# Altium project BQ79616-Q1_BMS_Slave.PrjPcb (part 1 of 2)
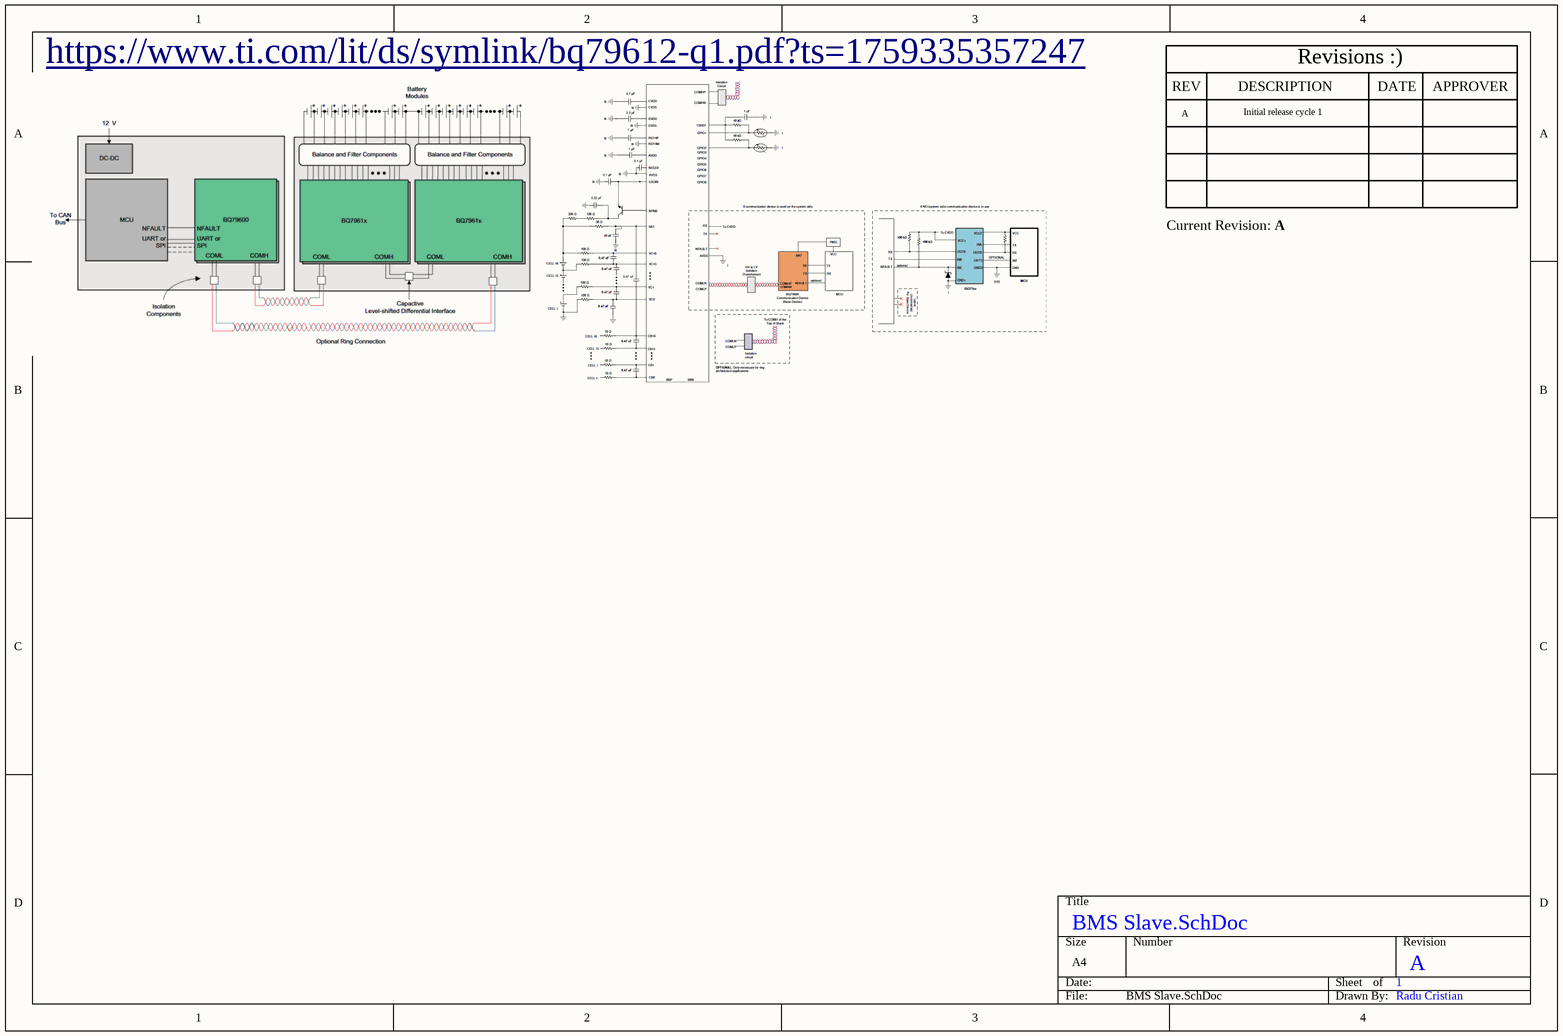
[diagram p0: BMS Slave.SchDoc]
Revision: A
8 sheets, 174 parts. Net scope: flat (ports and power ports of the same name join across sheets).
Board file: BMS_Slave_RevA.PcbDoc
Sheets:
  BMS Slave.SchDoc
  BQ chip.SchDoc
  Power Delivery.SchDoc
  Cell Balancing.SchDoc
  Cell Voltage Sensing.SchDoc
  Thermistors.SchDoc
  Communication.SchDoc
  Connectors.SchDoc

## Sheet BMS Slave.SchDoc
size A4; SheetNumber: 1; SheetTotal: 8

### Notes on the sheet
- https://www.ti.com/lit/ds/symlink/bq79612-q1.pdf?ts=1759335357247
- REV
- A
- DESCRIPTION
- Initial release cycle 1
- Revisions :)
- DATE
- APPROVER
- Current Revision:
- Radu Cristian

## Sheet BQ chip.SchDoc
size A4; SheetNumber: 2; SheetTotal: 8
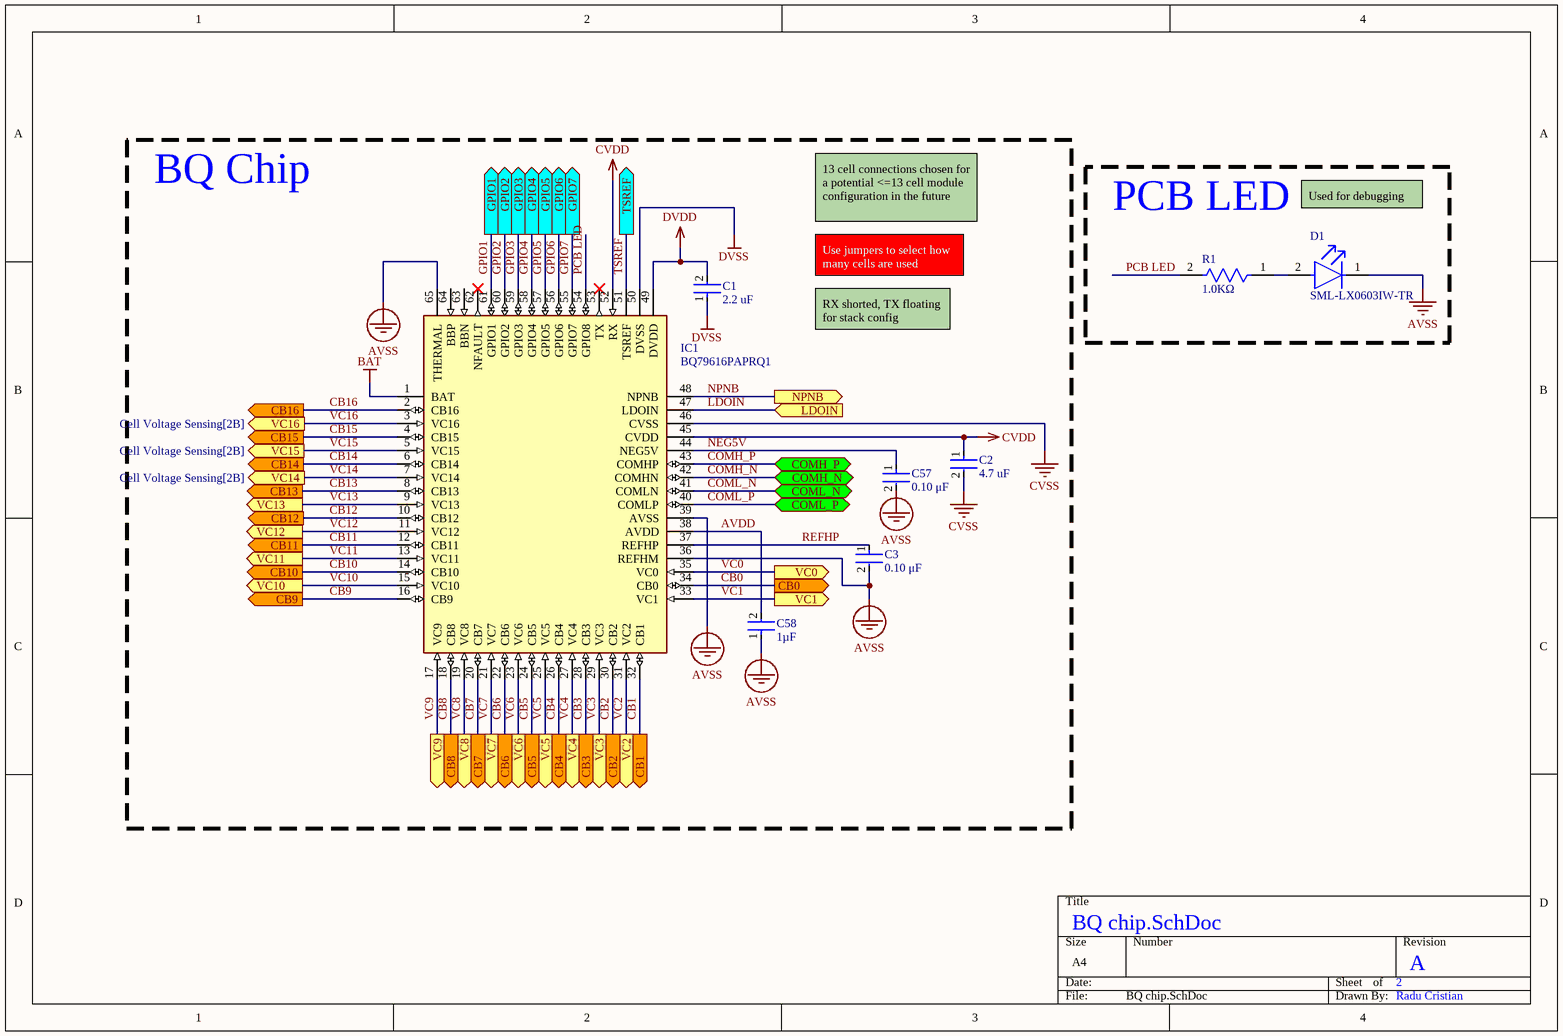
[diagram p1: BQ chip.SchDoc]

### Parts
C1  Capacitance: 2.2 uF  [FP-CC0603-DA-MFG]  (hidden comment: CC0603KPX7R6BB225)
C2  Capacitance: 4.7 uF  [FP-CC0603-DA-MFG]  (hidden comment: CC0603KRX5R7BB475)
C3  value 0.10 μF  [FP-C0603C-CF-MFG]  (hidden comment: C0603C104J5RAC)
C57  value 0.10 μF  [FP-C0603C-CF-MFG]  (hidden comment: C0603C104J5RAC)
C58  Capacitance: 1µF  [FP-VJ0603Y105KXJCW1BC-MFG]  (hidden comment: VJ0603Y105KXJCW1BC)
D1  SML-LX0603IW-TR  [FP-SML-LX0603IW-TR-MFG]
IC1  BQ79616PAPRQ1  [QFP50P1200X1200X120-65N]
R1  Resistance: 1.0KΩ  [FP-CPF0603-MFG]  (hidden comment: CPF0603F1K0C1)

### Blocks framed on the sheet
BQ Chip: C1-C3 C57 C58 IC1
PCB LED: D1 R1

### Ports
CB0 (out, see Cell Balancing[2D]), CB1 (out, see Cell Balancing[2D]), CB2 (out, see Cell Balancing[2D]), CB3 (out, see Cell Balancing[2C]), CB4 (out, see Cell Balancing[2C]), CB5 (out, see Cell Balancing[2C]), CB6 (out, see Cell Balancing[2C]), CB7 (out, see Cell Balancing[2C]), CB8 (out, see Cell Balancing[2C]), CB9 (out, see Cell Balancing[2B]), CB10 (out, see Cell Balancing[2B]), CB11 (out, see Cell Balancing[2B]), CB12 (out, see Cell Balancing[2B]), CB13 (out, see Cell Balancing[2B]), CB14 (out, see Cell Balancing[2B]), CB15 (out, see Cell Balancing[2B]), CB16 (out, see Cell Balancing[2A]), COMH_N (bidir, see Communication[1C]), COMH_P (bidir, see Communication[1B]), COML_N (bidir, see Communication[1A]), COML_P (bidir, see Communication[1B]), GPIO1 (out, see Thermistors[1D]), GPIO2 (out, see Thermistors[1D]), GPIO3 (out, see Thermistors[1C]), GPIO4 (out, see Thermistors[1C]), GPIO5 (out, see Thermistors[1C]), GPIO6 (out, see Thermistors[1A]), GPIO7 (out, see Thermistors[1A]), LDOIN (in, see Power Delivery[1C]), NPNB (out, see Power Delivery[1C]), TSREF (out, see Thermistors[1A], Thermistors[1B]), VC0 (out, see Cell Voltage Sensing[2D]), VC1 (out, see Cell Voltage Sensing[2D]), VC2 (out, see Cell Voltage Sensing[2D]), VC3 (out, see Cell Voltage Sensing[2D]), VC4 (out, see Cell Voltage Sensing[2C]), VC5 (out, see Cell Voltage Sensing[2C]), VC6 (out, see Cell Voltage Sensing[2C]), VC7 (out, see Cell Voltage Sensing[2C]), VC8 (out, see Cell Voltage Sensing[2C]), VC9 (out, see Cell Voltage Sensing[2C]), VC10 (out, see Cell Voltage Sensing[2B]), VC11 (out, see Cell Voltage Sensing[2B]), VC12 (out, see Cell Voltage Sensing[2B]), VC13 (out, see Cell Voltage Sensing[2B]), VC14 (out, see Cell Voltage Sensing[2B]), VC15 (out, see Cell Voltage Sensing[2B]), VC16 (out, see Cell Voltage Sensing[2B])

### Nets
AVSS: C3.2 C57.2 C58.1 D1.1(C) IC1.36(REFHM) IC1.39(AVSS) IC1.65(THERMAL)
BAT: IC1.1(BAT)
CVDD: C2.1 IC1.45(CVDD) IC1.52(RX)
CVSS: C2.2 IC1.46(CVSS)
DVDD: C1.2 IC1.49(DVDD)
DVSS: C1.1 IC1.50(DVSS)
AVDD: C58.2 IC1.38(AVDD)
CB0: IC1.34(CB0) ; port CB0
CB1: IC1.32(CB1) ; port CB1
CB2: IC1.30(CB2) ; port CB2
CB3: IC1.28(CB3) ; port CB3
CB4: IC1.26(CB4) ; port CB4
CB5: IC1.24(CB5) ; port CB5
CB6: IC1.22(CB6) ; port CB6
CB7: IC1.20(CB7) ; port CB7
CB8: IC1.18(CB8) ; port CB8
CB9: IC1.16(CB9) ; port CB9
CB10: IC1.14(CB10) ; port CB10
CB11: IC1.12(CB11) ; port CB11
CB12: IC1.10(CB12) ; port CB12
CB13: IC1.8(CB13) ; port CB13
CB14: IC1.6(CB14) ; port CB14
CB15: IC1.4(CB15) ; port CB15
CB16: IC1.2(CB16) ; port CB16
COMH_N: IC1.42(COMHN) ; port COMH_N
COMH_P: IC1.43(COMHP) ; port COMH_P
COML_N: IC1.41(COMLN) ; port COML_N
COML_P: IC1.40(COMLP) ; port COML_P
GPIO1: IC1.61(GPIO1) ; port GPIO1
GPIO2: IC1.60(GPIO2) ; port GPIO2
GPIO3: IC1.59(GPIO3) ; port GPIO3
GPIO4: IC1.58(GPIO4) ; port GPIO4
GPIO5: IC1.57(GPIO5) ; port GPIO5
GPIO6: IC1.56(GPIO6) ; port GPIO6
GPIO7: IC1.55(GPIO7) ; port GPIO7
LDOIN: IC1.47(LDOIN) ; port LDOIN
NEG5V: C57.1 IC1.44(NEG5V)
NPNB: IC1.48(NPNB) ; port NPNB
PCB LED: IC1.54(GPIO8) R1.2
REFHP: C3.1 IC1.37(REFHP)
TSREF: IC1.51(TSREF) ; port TSREF
VC0: IC1.35(VC0) ; port VC0
VC1: IC1.33(VC1) ; port VC1
VC2: IC1.31(VC2) ; port VC2
VC3: IC1.29(VC3) ; port VC3
VC4: IC1.27(VC4) ; port VC4
VC5: IC1.25(VC5) ; port VC5
VC6: IC1.23(VC6) ; port VC6
VC7: IC1.21(VC7) ; port VC7
VC8: IC1.19(VC8) ; port VC8
VC9: IC1.17(VC9) ; port VC9
VC10: IC1.15(VC10) ; port VC10
VC11: IC1.13(VC11) ; port VC11
VC12: IC1.11(VC12) ; port VC12
VC13: IC1.9(VC13) ; port VC13
VC14: IC1.7(VC14) ; port VC14
VC15: IC1.5(VC15) ; port VC15
VC16: IC1.3(VC16) ; port VC16
NetD1_2: D1.2(A) R1.1

Not connected (* = marked no-connect by the designer): IC1 53(TX)* 62(NFAULT)* 63(BBN) 64(BBP)

### Notes on the sheet
- 13 cell connections chosen for a potential <=13 cell module configuration in the future
- Used for debugging
- Use jumpers to select how many cells are used
- RX shorted, TX floating for stack config
- Radu Cristian

### Library data of the parts
C1 = CMP-03422-000630-1: CC0603 2.2 uF X7R 10.00% 10 V; Manufacturer: YAGEO; Value: 2.2 uF; Tolerance: 0.1; Voltage Rating: 10 V; Temperature Coefficient: 15%; Material: Ceramic; Automotive: No; ComponentLink2URL: http://www.yageo.com/documents/recent/UPY-GPHC_X7R_6.3V-to-50V_18.pdf; Temperature Range Low: -55°C; Package: CC0603-DA; Lead Free: Yes; RoHS: TRUE; Manufacturer Part Number: CC0603KPX7R6BB225; Height: 0.9mm; Octopart: https://octopart.com/cc0603kpx7r6bb225-yageo-88116733; ComponentLink2Description: Datasheet; Category: Cap; Device Class L1: Passive Components; Temperature: -55°C to +125°C; Footprint Url: http://www.yageo.com/exep/pages/download/literatures/UPY-C_GEN_24.pdf; Voltage: 10 V; Temperature Range High: +125°C; Device Class L3: Ceramic Capacitors; Device Class L2: Capacitors; Temperature Characteristic: X7R
C2 = CMP-03422-001236-1: CAP CER 4.7UF 16V X5R 0603; Manufacturer: YAGEO; Temperature Coefficient: 15%; Material: Ceramic; Tolerance: 0.1; Temperature Characteristic: X5R; Footprint Url: http://www.yageo.com/exep/pages/download/literatures/UPY-C_GEN_24.pdf; ComponentLink2URL: http://www.yageo.com/documents/recent/UPY-GPHC_X7R_6.3V-to-50V_18.pdf; ComponentLink2Description: Datasheet; Device Class L3: Ceramic Capacitors; Category: Cap; Voltage Rating: 16 V; Automotive: No; Temperature Range High: +125°C; Value: 4.7 uF; Device Class L1: Passive Components; RoHS: TRUE; Manufacturer Part Number: CC0603KRX5R7BB475; Device Class L2: Capacitors; Voltage: 16 V; Height: 0.9mm; Temperature Range Low: -55°C; Temperature: -55°C to +125°C; Mouser Description: Multilayer Ceramic Capacitors MLCC - SMD/SMT 4.7uF 16V X5R 10%; Octopart: https://octopart.com/cc0603krx5r7bb475-yageo-34978295; Package: CC0603-DA; Lead Free: Yes; Digikey Description: CAP CER 4.7UF 16V X5R 0603
C3 C57 = CMP-03020-003374-1: C0603 0.10 μF X7R 30ppm/°C 5.00% 50 V; Manufacturer: KEMET; Automotive Grade: Grade 1; Voltage Rating: 50 V; Tolerance: 0.05; Material: Ceramic; Manufacturer Part Number: C0603C104J5RAC; Mouser Description: Cap Ceramic 0.1uF 50V X7R 5% Pad SMD 0603 125C Bulk; Temperature Range High: +125°C; Package: C0603C-CF; Device Class L1: Passive Components; Temperature Range Low: -55°C; Capacitance: 0.10 μF; Category: Cap; ComponentLink2Description: Datasheet; Lead Free: Yes; Temperature Coefficient: 30ppm/°C; Octopart: https://octopart.com/c0603c104j5rac-kemet-8089723; Automotive: Yes; Temperature Characteristic: X7R; ComponentLink2URL: https://api.kemet.com/component-edge/download/datasheet/C0603C100J5GACAUTO.pdf; Height: 0.87mm; Device Class L2: Capacitors; Device Class L3: Ceramic Capacitors; Temperature: -55°C to +125°C; RoHS: TRUE
C58 = CMP-00030-45106517-1: VJ0603Y105KXJCW1BC Multilayer Ceramic Capacitor, 1 uF, 16 V, ± 10%, X7R, 0603 [1608 Metric]; Voltage Rating: 16V; Dielectric Material: Tantalum; Radiation Hardening: No; RoHS: Compliant; Packaging: Tape and Reel; Material: Ceramic; Height: 950µm; Voltage Rating (DC): 16V; Tolerance: 10%; NexarPartId: 45106517; Min Operating Temperature: -55°C; Depth: 800µm; Case/Package: 0603; Length: 1.6mm; Max Operating Temperature: 125°C; Mount: Surface Mount; Lead Free: Lead Free; Dielectric: X7R
D1 = CMP-57192-000012-1: LED RED DIFFUSED SMD; Luminous Intensity: 14mcd; Test Current: 20mA; Viewing Angle: 160°; Approvals: UL; Forward Voltage: 2V; Power Dissipation: 50mW; Dominant Wavelength: 635nm; Number of LEDs: 1; Lens Color: White; Height: 0.6mm; RoHS Compliant: Yes; Lead Free: Lead Free; Number of Pins: 2; Packaging: Tape and Reel; Case/Package: 0603; Length: 1.6mm; Color: Red; Max Operating Temperature: 85°C; Illumination Color: Red; Case Code (Metric): 1608; Diameter: 0.061inch; Min Operating Temperature: -25°C; Lens Style: Diffused; Mount: Surface Mount; Width: 0.8mm; Case Code (Imperial): 0603; Lens Transparency: Diffused; Wavelength: 635nm; Package Quantity: 1; Forward Current: 20mA
IC1 = BQ79616PAPRQ1: 16-S automotive precision battery monitor, balancer and integrated protector with ASIL-D compliance; Manufacturer_Name: Texas Instruments; Datasheet Link: https://www.ti.com/lit/ds/symlink/bq79616-q1.pdf?ts=1617242170659&ref_url=https%253A%252F%252Fwww.ti.com%252Fproduct%252FBQ79616-Q1; Height: 1.2mm; Manufacturer_Part_Number: BQ79616PAPRQ1; Mouser Part Number: 595-BQ79616PAPRQ1; Mouser Price/Stock: https://www.mouser.co.uk/ProductDetail/Texas-Instruments/BQ79616PAPRQ1?qs=eP2BKZSCXI7ZLEv8EAihLQ%3D%3D; Arrow Part Number: BQ79616PAPRQ1; Arrow Price/Stock: https://www.arrow.com/en/products/bq79616paprq1/texas-instruments?region=nac; Supplier 1: DigiKey; Supplier Part Number 1: 296-BQ79616PAPRQ1CT-ND
R1 = CMP-03211-002621-1: RES SMD 1.0KΩ 1% 1/16W 0603; Manufacturer: TE Connectivity; Power Rating: 0.063W; Voltage Rating: 50V; Temperature Coefficient: 50ppm/°C; Octopart: https://octopart.com/cpf0603f1k0c1-te+connectivity-42013134; packaging: 1k Reel; Category: Res; Device Class L3: Chip SMD Resistors; octopart_url: https://octopart.com/cpf0603f1k0c1-te+connectivity-42013134; Value: 1.0KΩ; Temperature: -55°C to +155°C; Composition: Thin Film; ComponentLink2URL: https://www.te.com/commerce/DocumentDelivery/DDEController?Action=showdoc&DocId=Data+Sheet%7F1773200%7FM%7Fpdf%7FEnglish%7FENG_DS_1773200_M.pdf%7F3-1676481-2; Tolerance: 1%; Automotive: No; Lead Free: Yes; Height: 0.55mm; Device Class L1: Passive Components; Device Class L2: Resistors; Ipc Land Pattern Name: RESC15580X45; Series: CPF; ComponentLink2Description: Datasheet; RoHS: TRUE; Package: CPF0603; Manufacturer Part Number: CPF0603F1K0C1; Temperature Range Low: -55°C; Temperature Range High: +155°C

## Sheet Power Delivery.SchDoc
size A4; SheetNumber: 3; SheetTotal: 8
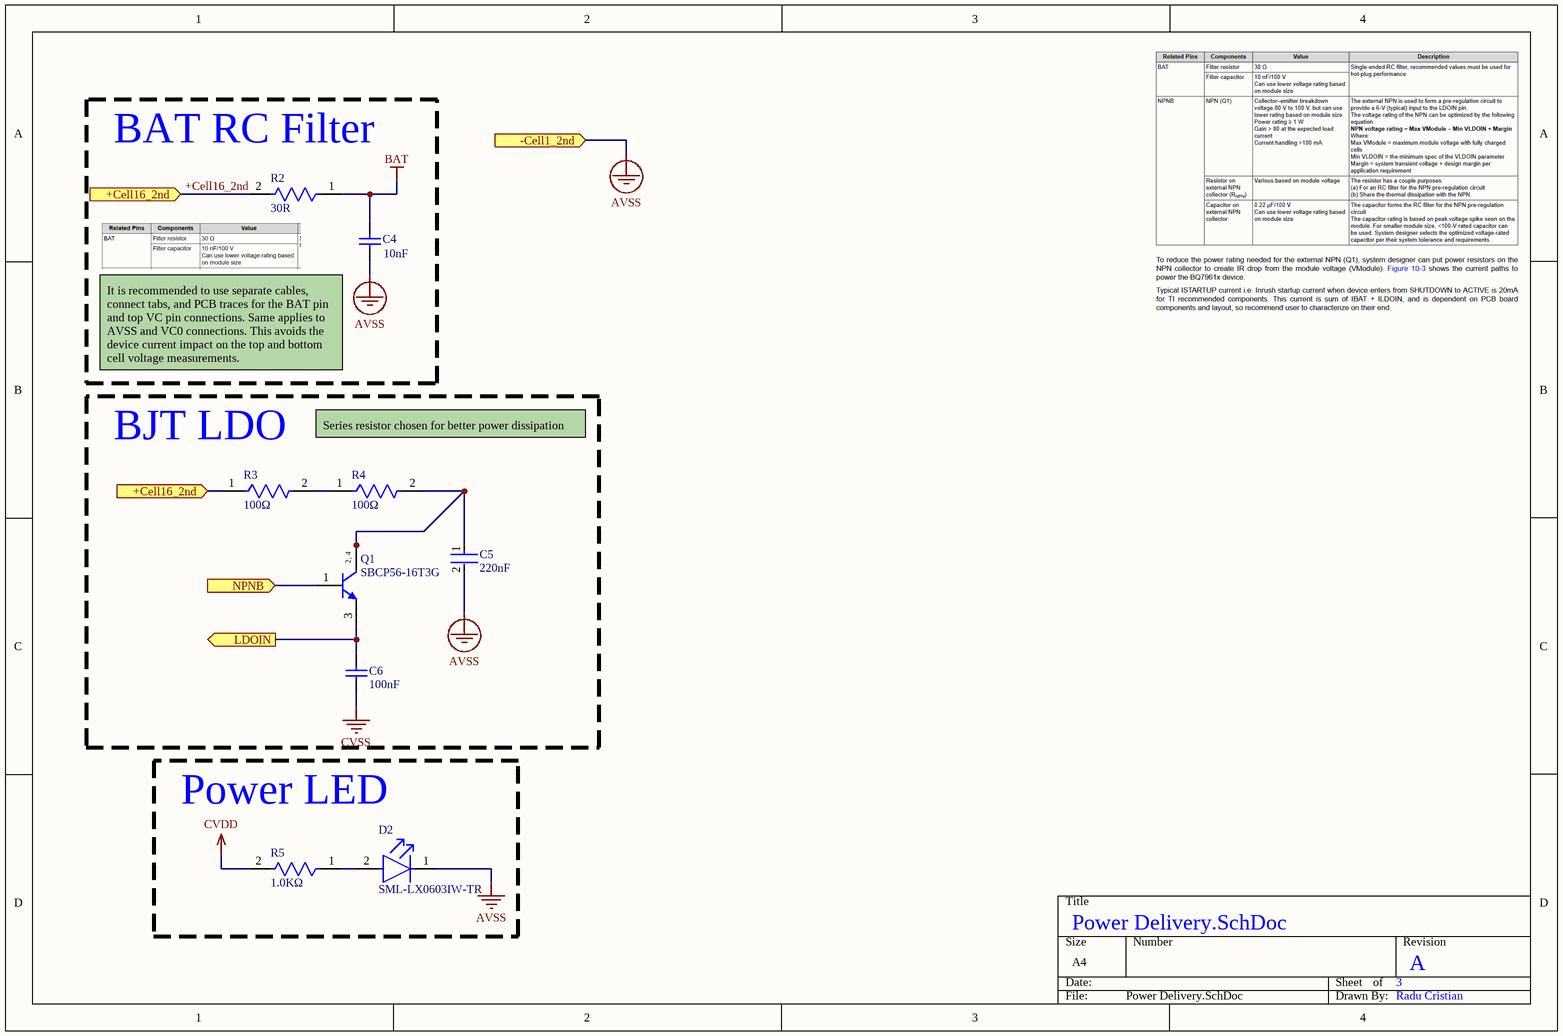
[diagram p2: Power Delivery.SchDoc]

### Parts
C4  Parameter 1: 10nF  [CAPC1608X92X38LL15T08]  (hidden comment: VJ0603Y103JXBAC)
C5  Capacitance: 220nF  [FP-0805-L_2_01_0_2-W_1_25-MFG]  (hidden comment: 08051C224K4T2A)
C6  Parameter 1: 100nF  [CAPC1608X92X38ML15T08]  (hidden comment: VJ0603Y104KXAAT)
D2  SML-LX0603IW-TR  [FP-SML-LX0603IW-TR-MFG]
Q1  SBCP56-16T3G  [ONSC-SOT-223-4-318E-04_V]
R2  Resistance: 30R  [FP-AC0603-IPC_C]  (hidden comment: AC0603FR-0730RL)
R3  Resistance: 100Ω  [FP-SR0805-MFG]  (hidden comment: SR0805FR-47100RL)
R4  Resistance: 100Ω  [FP-SR0805-MFG]  (hidden comment: SR0805FR-47100RL)
R5  Resistance: 1.0KΩ  [FP-CPF0603-MFG]  (hidden comment: CPF0603F1K0C1)

### Blocks framed on the sheet
BAT RC Filter: C4 R2
BJT LDO: C5 C6 Q1 R3 R4
Power LED: D2 R5

### Ports
+Cell16_2nd (in, see Connectors[2C], Power Delivery[1A]), +Cell16_2nd (in, see Connectors[2C], Power Delivery[1B]), -Cell1_2nd (in, see Connectors[1A]), LDOIN (out, see BQ chip[2B]), NPNB (in, see BQ chip[2B])

### Nets
AVSS: C4.1 C5.2 D2.1(C) ; port -Cell1_2nd
BAT: C4.2 R2.1
CVDD: R5.2
CVSS: C6.1
+Cell16_2nd: R2.2 R3.1 ; port +Cell16_2nd
LDOIN: C6.2 Q1.3(E) ; port LDOIN
NPNB: Q1.1(B) ; port NPNB
NetC5_1: C5.1 Q1.2(C) Q1.4(C) R4.2
NetD2_2: D2.2(A) R5.1
NetR3_2: R3.2 R4.1

### Notes on the sheet
- (near C4) It is recommended to use separate cables, connect tabs, and PCB traces for the BAT pin and top VC pin connections. Same applies to AVSS and VC0 connections. This avoids the device current impact on the top and bottom cell voltage measurements.
- Series resistor chosen for better power dissipation
- Radu Cristian
- (in symbol CMP-1048-00520-1) 2, 4

### Library data of the parts
C4 = CMP-2006-01162-1: Manufacturer: Vitramon; Part Number: VJ0603Y103JXBAC
C5 = CMP-04427-012849-1: Automotive Ceramic Capacitor, 0805, 220nF, 10%, X7R, 15%, 100V; Voltage Rating (DC): 100V; Dielectric: X7R; Length: 2.01mm; Contact Plating: Tin; Termination: Wraparound; Case/Package: 0805; RoHS Compliant: Yes; Tolerance: 10%; Max Operating Temperature: 125°C; Min Operating Temperature: -55°C; Mount: Surface Mount
C6 = CMP-2006-00164-1: Ceramic Capacitor, Multilayer, Ceramic, 50V, 10% +Tol, 10% -Tol, X7R, 15% TC, 0.1uF, Surface Mount, 0603; Manufacturer: Vishay; Part Number: VJ0603Y104KXAAT
D2 = CMP-57192-000012-1: as D1 on sheet BQ chip; Height: 0.6mm; RoHS Compliant: Yes; Lead Free: Lead Free; Number of Pins: 2; Packaging: Tape and Reel; Case/Package: 0603; Length: 1.6mm; Color: Red; Max Operating Temperature: 85°C; Illumination Color: Red; Case Code (Metric): 1608; Diameter: 0.061inch; Min Operating Temperature: -25°C; Lens Style: Diffused; Mount: Surface Mount; Width: 0.8mm; Case Code (Imperial): 0603; Lens Transparency: Diffused; Wavelength: 635nm; Package Quantity: 1; Forward Current: 20mA
Q1 = CMP-1048-00520-1: NPN Silicon Epitaxial Transistor, 4-Pin SOT-223, Pb-Free, Tape and Reel; Manufacturer: On Semiconductor; IC Continuous (A): 1; RoHS: TRUE; ComponentLink1URL: http://www.onsemi.com/; PackageReference: SOT-223-4-318E-04; PackageDescription: 4-Pin Small Outline Transistor, Body 6.5 x 3.5 mm, Pitch 2.3 mm; PackageVersion: Rev. N, 08/2009; Polarity: NPN; ComponentLink1Description: Manufacturer URL; Mounting Technology: Surface Mount; PartNumber: SBCP56-16T3G; DatasheetVersion: Rev. 8; ComponentLink2URL: http://www.onsemi.com/pub_link/Collateral/BCP56T1-D.PDF; ComponentLink2Description: Datasheet; ComponentLink3URL: http://www.onsemi.com/pub_link/Collateral/318E-04.PDF; ComponentLink3Description: Package Specification; Packing: Tape and Reel
R2 = CMP-03412-028950-2: RES 30Ω 1.00% 0.1W 0603; Tolerance: 1%; Max Power Dissipation: 100mW; Temperature Coefficient: 100ppm/°C; Features: Moisture Resistant; Packaging: Tape and Reel; Number of Terminations: 2; Case/Package: 0603; Length: 0.063inch; Resistor Type: Thick Film; Series: AC; RoHS Compliant: Yes; Height: 0.022inch; Width: 0.031inch; Max Operating Temperature: 155°C; Min Operating Temperature: -55°C
R3 R4 = CMP-03412-018383-1: RES 100 OHM 1% 1/2W 0805; Manufacturer: Yageo; Automotive Grade: Grade 0; Value: 100Ω; Tolerance: 0.01; Power Rating: 0.5W; Voltage Rating: 150V; Lead Free: Yes; Temperature Range High: +155°C; Category: Res; Temperature: -55°C to +155°C; Device Class L3: Chip SMD Resistors; Device Class L1: Passive Components; Temperature Range Low: -55°C; Digikey Description: RES 100 OHM 1% 1/2W 0805; RoHS: TRUE; Series: SR; Package: SR0805; Ipc Land Pattern Name: RESC200125X50; ComponentLink2URL: http://www.yageo.com/documents/recent/PYu-SR_D_F%20tol_RoHS_L_3.pdf; Automotive: Yes; Octopart: https://octopart.com/sr0805fr-47100rl-yageo-91478093; Composition: Thick Film; Device Class L2: Resistors; Height: 0.6mm; ComponentLink2Description: Datasheet; Manufacturer Part Number: SR0805FR-47100RL; Footprint Url: http://www.yageo.com/exep/pages/download/literatures/PYu-R_Mount_10.pdf
R5 = CMP-03211-002621-1: as R1 on sheet BQ chip; Octopart: https://octopart.com/cpf0603f1k0c1-te+connectivity-42013134; packaging: 1k Reel; Category: Res; Device Class L3: Chip SMD Resistors; octopart_url: https://octopart.com/cpf0603f1k0c1-te+connectivity-42013134; Value: 1.0KΩ; Temperature: -55°C to +155°C; Composition: Thin Film; ComponentLink2URL: https://www.te.com/commerce/DocumentDelivery/DDEController?Action=showdoc&DocId=Data+Sheet%7F1773200%7FM%7Fpdf%7FEnglish%7FENG_DS_1773200_M.pdf%7F3-1676481-2; Tolerance: 1%; Automotive: No; Lead Free: Yes; Height: 0.55mm; Device Class L1: Passive Components; Device Class L2: Resistors; Ipc Land Pattern Name: RESC15580X45; Series: CPF; ComponentLink2Description: Datasheet; RoHS: TRUE; Package: CPF0603; Manufacturer Part Number: CPF0603F1K0C1; Temperature Range Low: -55°C; Temperature Range High: +155°C

## Sheet Cell Balancing.SchDoc
size A4; SheetNumber: 4; SheetTotal: 8
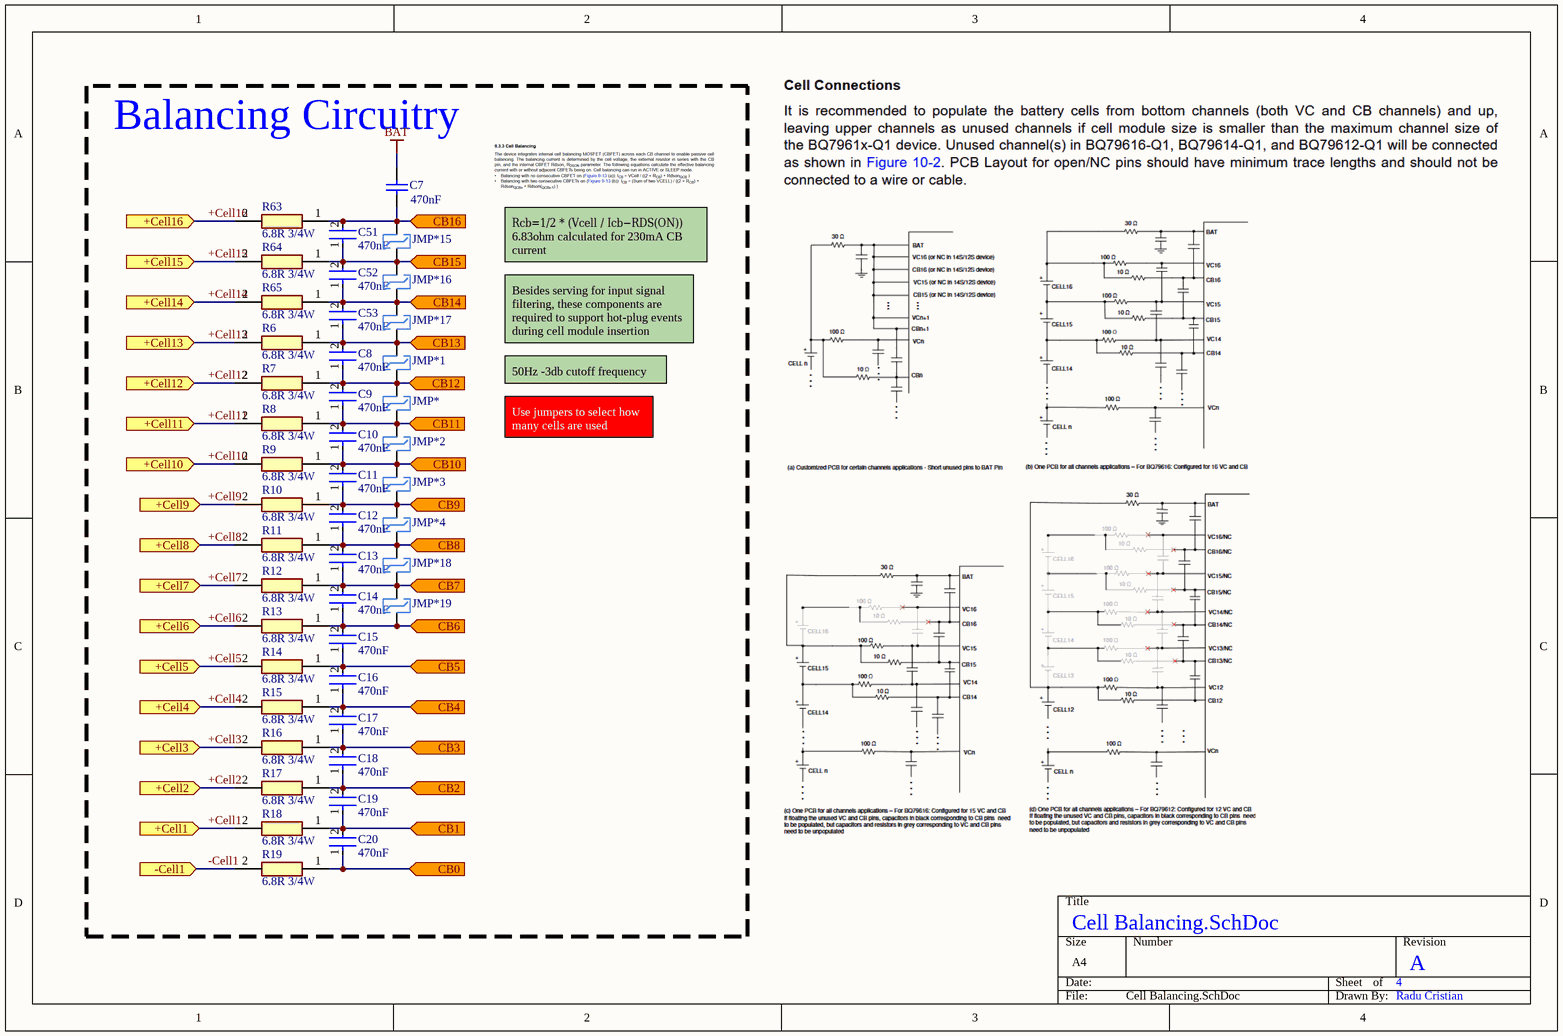
[diagram p3: Cell Balancing.SchDoc]

### Parts
C7  value 470nF  [CAPC0603(1608)100_N]  (hidden comment: CAP 470nF 25V 0603(1608))
C8  Capacitance: 470nF  [FP-0805-L_2_01_0_2-W_1_25-IPC_C]  (hidden comment: 08055C474J4Z2A)
C9  Capacitance: 470nF  [FP-0805-L_2_01_0_2-W_1_25-IPC_C]  (hidden comment: 08055C474J4Z2A)
C10  Capacitance: 470nF  [FP-0805-L_2_01_0_2-W_1_25-IPC_C]  (hidden comment: 08055C474J4Z2A)
C11  Capacitance: 470nF  [FP-0805-L_2_01_0_2-W_1_25-IPC_C]  (hidden comment: 08055C474J4Z2A)
C12  Capacitance: 470nF  [FP-0805-L_2_01_0_2-W_1_25-IPC_C]  (hidden comment: 08055C474J4Z2A)
C13  Capacitance: 470nF  [FP-0805-L_2_01_0_2-W_1_25-IPC_C]  (hidden comment: 08055C474J4Z2A)
C14  Capacitance: 470nF  [FP-0805-L_2_01_0_2-W_1_25-IPC_C]  (hidden comment: 08055C474J4Z2A)
C15  Capacitance: 470nF  [FP-0805-L_2_01_0_2-W_1_25-IPC_C]  (hidden comment: 08055C474J4Z2A)
C16  Capacitance: 470nF  [FP-0805-L_2_01_0_2-W_1_25-IPC_C]  (hidden comment: 08055C474J4Z2A)
C17  Capacitance: 470nF  [FP-0805-L_2_01_0_2-W_1_25-IPC_C]  (hidden comment: 08055C474J4Z2A)
C18  Capacitance: 470nF  [FP-0805-L_2_01_0_2-W_1_25-IPC_C]  (hidden comment: 08055C474J4Z2A)
C19  Capacitance: 470nF  [FP-0805-L_2_01_0_2-W_1_25-IPC_C]  (hidden comment: 08055C474J4Z2A)
C20  Capacitance: 470nF  [FP-0805-L_2_01_0_2-W_1_25-IPC_C]  (hidden comment: 08055C474J4Z2A)
C51  Capacitance: 470nF  [FP-0805-L_2_01_0_2-W_1_25-IPC_C]  (hidden comment: 08055C474J4Z2A)
C52  Capacitance: 470nF  [FP-0805-L_2_01_0_2-W_1_25-IPC_C]  (hidden comment: 08055C474J4Z2A)
C53  Capacitance: 470nF  [FP-0805-L_2_01_0_2-W_1_25-IPC_C]  (hidden comment: 08055C474J4Z2A)
JMP*  Solder Jumper  [Solder Jumper-Footprint-1]  (value not drawn)
JMP*1  Solder Jumper  [Solder Jumper-Footprint-1]  (value not drawn)
JMP*2  Solder Jumper  [Solder Jumper-Footprint-1]  (value not drawn)
JMP*3  Solder Jumper  [Solder Jumper-Footprint-1]  (value not drawn)
JMP*4  Solder Jumper  [Solder Jumper-Footprint-1]  (value not drawn)
JMP*15  Solder Jumper  [Solder Jumper-Footprint-1]  (value not drawn)
JMP*16  Solder Jumper  [Solder Jumper-Footprint-1]  (value not drawn)
JMP*17  Solder Jumper  [Solder Jumper-Footprint-1]  (value not drawn)
JMP*18  Solder Jumper  [Solder Jumper-Footprint-1]  (value not drawn)
JMP*19  Solder Jumper  [Solder Jumper-Footprint-1]  (value not drawn)
R6  Parameter 1: 6.8R 3/4W  [RESC3116X65N]  (hidden comment: CRCW12066R80JNEAHP)
R7  Parameter 1: 6.8R 3/4W  [RESC3116X65N]  (hidden comment: CRCW12066R80JNEAHP)
R8  Parameter 1: 6.8R 3/4W  [RESC3116X65N]  (hidden comment: CRCW12066R80JNEAHP)
R9  Parameter 1: 6.8R 3/4W  [RESC3116X65N]  (hidden comment: CRCW12066R80JNEAHP)
R10  Parameter 1: 6.8R 3/4W  [RESC3116X65N]  (hidden comment: CRCW12066R80JNEAHP)
R11  Parameter 1: 6.8R 3/4W  [RESC3116X65N]  (hidden comment: CRCW12066R80JNEAHP)
R12  Parameter 1: 6.8R 3/4W  [RESC3116X65N]  (hidden comment: CRCW12066R80JNEAHP)
R13  Parameter 1: 6.8R 3/4W  [RESC3116X65N]  (hidden comment: CRCW12066R80JNEAHP)
R14  Parameter 1: 6.8R 3/4W  [RESC3116X65N]  (hidden comment: CRCW12066R80JNEAHP)
R15  Parameter 1: 6.8R 3/4W  [RESC3116X65N]  (hidden comment: CRCW12066R80JNEAHP)
R16  Parameter 1: 6.8R 3/4W  [RESC3116X65N]  (hidden comment: CRCW12066R80JNEAHP)
R17  Parameter 1: 6.8R 3/4W  [RESC3116X65N]  (hidden comment: CRCW12066R80JNEAHP)
R18  Parameter 1: 6.8R 3/4W  [RESC3116X65N]  (hidden comment: CRCW12066R80JNEAHP)
R19  Parameter 1: 6.8R 3/4W  [RESC3116X65N]  (hidden comment: CRCW12066R80JNEAHP)
R63  Parameter 1: 6.8R 3/4W  [RESC3116X65N]  (hidden comment: CRCW12066R80JNEAHP)
R64  Parameter 1: 6.8R 3/4W  [RESC3116X65N]  (hidden comment: CRCW12066R80JNEAHP)
R65  Parameter 1: 6.8R 3/4W  [RESC3116X65N]  (hidden comment: CRCW12066R80JNEAHP)

### Blocks framed on the sheet
Balancing Circuitry: C7-C20 C51-C53 JMP* JMP*1-JMP*4 JMP*15-JMP*19 R6-R19 R63-R65

### Ports
+Cell1 (in, see Cell Voltage Sensing[1D], Connectors[1A]), +Cell2 (in, see Cell Voltage Sensing[1D], Connectors[1B]), +Cell3 (in, see Cell Voltage Sensing[1D], Connectors[1B]), +Cell4 (in, see Cell Voltage Sensing[1C], Connectors[1B]), +Cell5 (in, see Cell Voltage Sensing[1C], Connectors[1B]), +Cell6 (in, see Cell Voltage Sensing[1C], Connectors[1B]), +Cell7 (in, see Cell Voltage Sensing[1C], Connectors[2A]), +Cell8 (in, see Cell Voltage Sensing[1C], Connectors[2A]), +Cell9 (in, see Cell Voltage Sensing[1C], Connectors[2A]), +Cell10 (in, see Cell Voltage Sensing[1B], Connectors[2B]), +Cell11 (in, see Cell Voltage Sensing[1B], Connectors[2B]), +Cell12 (in, see Cell Voltage Sensing[1B], Connectors[2B]), +Cell13 (in, see Cell Voltage Sensing[1B], Connectors[2B]), +Cell14 (in, see Cell Voltage Sensing[1B], Connectors[2B]), +Cell15 (in, see Cell Voltage Sensing[1B], Connectors[2B]), +Cell16 (in, see Cell Voltage Sensing[1B], Connectors[2B]), -Cell1 (in, see Cell Voltage Sensing[1D], Connectors[1A]), CB0 (in, see BQ chip[2C]), CB1 (in, see BQ chip[2D]), CB2 (in, see BQ chip[2D]), CB3 (in, see BQ chip[2D]), CB4 (in, see BQ chip[2D]), CB5 (in, see BQ chip[2D]), CB6 (in, see BQ chip[2D]), CB7 (in, see BQ chip[2D]), CB8 (in, see BQ chip[2D]), CB9 (in, see BQ chip[1C]), CB10 (in, see BQ chip[1C]), CB11 (in, see BQ chip[1C]), CB12 (in, see BQ chip[1C]), CB13 (in, see BQ chip[1B]), CB14 (in, see BQ chip[1B]), CB15 (in, see BQ chip[1B]), CB16 (in, see BQ chip[1B])

### Nets
BAT: C7.2
+Cell1: R18.2 ; port +Cell1
+Cell2: R17.2 ; port +Cell2
+Cell3: R16.2 ; port +Cell3
+Cell4: R15.2 ; port +Cell4
+Cell5: R14.2 ; port +Cell5
+Cell6: R13.2 ; port +Cell6
+Cell7: R12.2 ; port +Cell7
+Cell8: R11.2 ; port +Cell8
+Cell9: R10.2 ; port +Cell9
+Cell10: R9.2 ; port +Cell10
+Cell11: R8.2 ; port +Cell11
+Cell12: R7.2 ; port +Cell12
+Cell13: R6.2 ; port +Cell13
+Cell14: R65.2 ; port +Cell14
+Cell15: R64.2 ; port +Cell15
+Cell16: R63.2 ; port +Cell16
-Cell1: R19.2 ; port -Cell1
CB0: C20.1 R19.1 ; port CB0
CB1: C19.1 C20.2 R18.1 ; port CB1
CB2: C18.1 C19.2 R17.1 ; port CB2
CB3: C17.1 C18.2 R16.1 ; port CB3
CB4: C16.1 C17.2 R15.1 ; port CB4
CB5: C15.1 C16.2 R14.1 ; port CB5
CB6: C14.1 C15.2 JMP*19.1 R13.1 ; port CB6
CB7: C13.1 C14.2 JMP*18.1 JMP*19.2 R12.1 ; port CB7
CB8: C12.1 C13.2 JMP*4.1 JMP*18.2 R11.1 ; port CB8
CB9: C11.1 C12.2 JMP*3.1 JMP*4.2 R10.1 ; port CB9
CB10: C10.1 C11.2 JMP*2.1 JMP*3.2 R9.1 ; port CB10
CB11: C9.1 C10.2 JMP*.1 JMP*2.2 R8.1 ; port CB11
CB12: C8.1 C9.2 JMP*.2 JMP*1.1 R7.1 ; port CB12
CB13: C8.2 C53.1 JMP*1.2 JMP*17.1 R6.1 ; port CB13
CB14: C52.1 C53.2 JMP*16.1 JMP*17.2 R65.1 ; port CB14
CB15: C51.1 C52.2 JMP*15.1 JMP*16.2 R64.1 ; port CB15
CB16: C7.1 C51.2 JMP*15.2 R63.1 ; port CB16

### Notes on the sheet
- Rcb=1/2 * ​(Vcell / Icb​​−RDS(ON)​)
  6.83ohm calculated for 230mA CB current
- 50Hz -3db cutoff frequency
- Besides serving for input signal filtering, these components are required to support hot-plug events during cell module insertion
- Use jumpers to select how many cells are used
- Radu Cristian

### Library data of the parts
C7 = CMP-1035-02704-1: CAP 470nF 25V ±20% 0603 (1608 Metric) Thickness 1mm SMD; Case-Metric: 1608; Case-EIA: 0603; Tolerance: Â±20%; Technology: SMT; Rated Voltage: 25 V; Max Thickness: 1 mm
C8-C20 C51-C53 = CMP-04427-003155-1: Automotive Ceramic Capacitor, 0805, 470nF, 5%, X7R, 15%, 50V; Dielectric: X7R; Depth: 1.25mm; Max Operating Temperature: 125°C; Mount: Surface Mount; Radiation Hardening: No; Construction: Flat; Packaging: Tape and Reel; Min Operating Temperature: -55°C; Length: 2.01mm; RoHS Compliant: Yes; Voltage Rating (DC): 50V; Case/Package: 0805; Tolerance: 5%; Package Quantity: 2000
JMP* JMP*1-JMP*4 JMP*15-JMP*19 = CMP-00000-3: 2 port solder jumper
R6-R19 R63-R65 = CRCW12066R80JNEAHP: Thick Film Resistors - SMD 3/4watt 6.8ohm 5% High Power AEC-Q200; Manufacturer_Name: Vishay; Height: 0.65mm; Manufacturer_Part_Number: CRCW12066R80JNEAHP; Supplier 1: DigiKey; Supplier Part Number 1: 541-CRCW12066R80JNEAHPCT-ND

## Sheet Cell Voltage Sensing.SchDoc
size A4; SheetNumber: 5; SheetTotal: 8
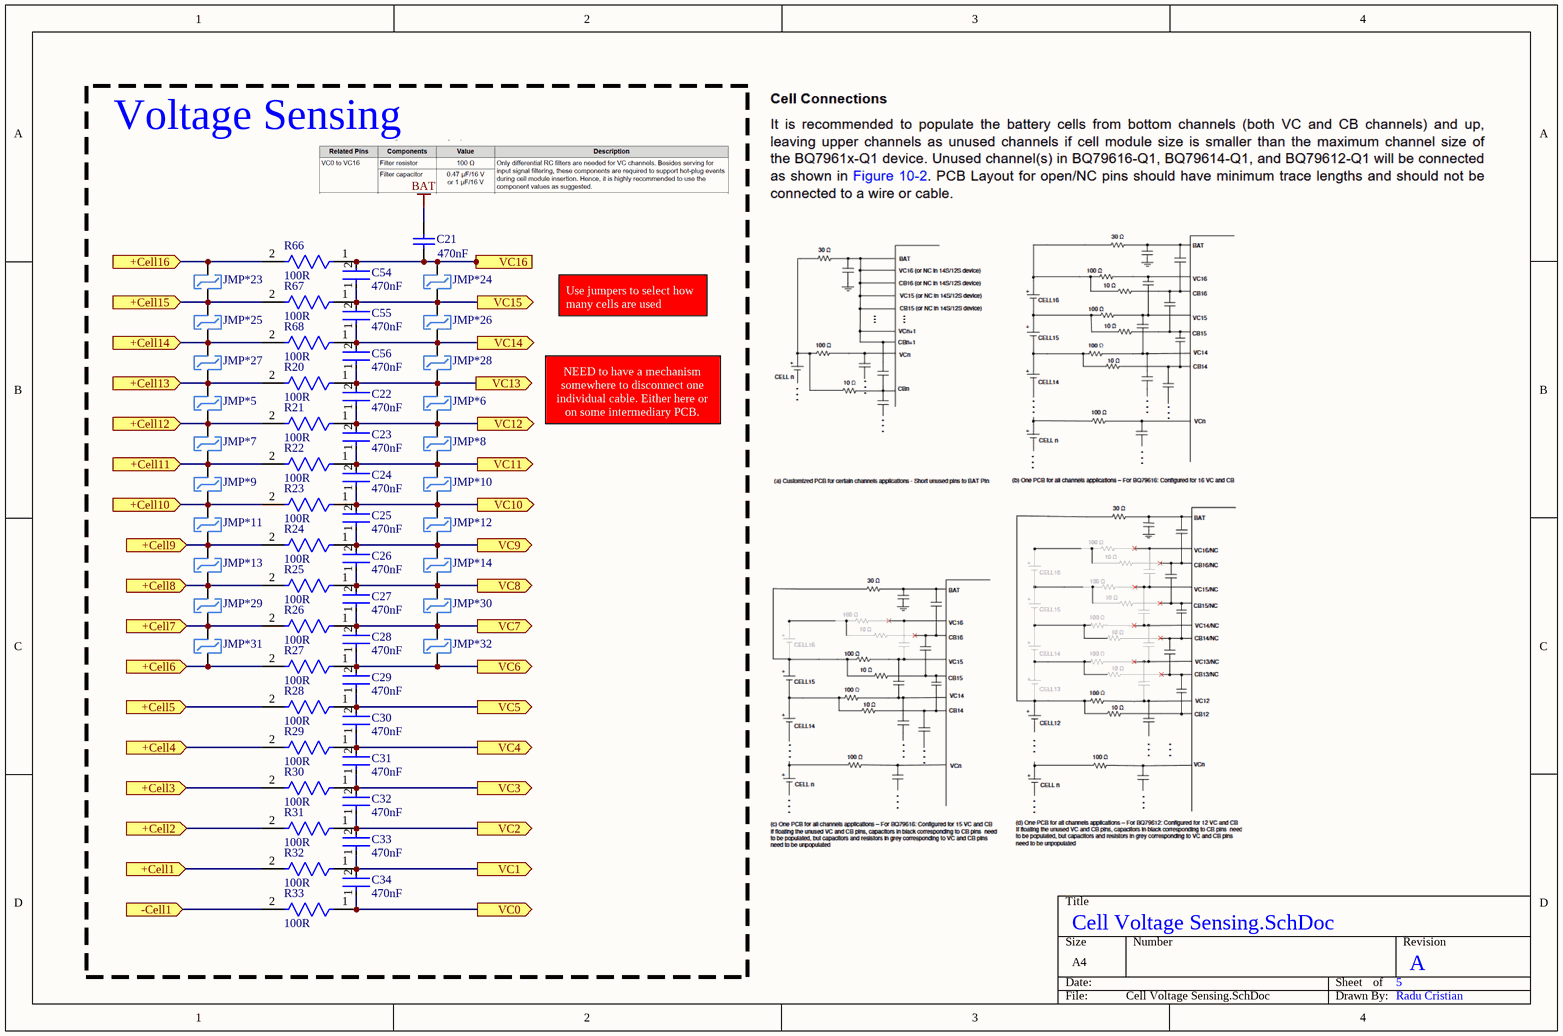
[diagram p4: Cell Voltage Sensing.SchDoc]

### Parts
C21  value 470nF  [CAPC0603(1608)100_N]  (hidden comment: CAP 470nF 25V 0603(1608))
C22  Capacitance: 470nF  [FP-0805-L_2_01_0_2-W_1_25-IPC_C]  (hidden comment: 08055C474J4Z2A)
C23  Capacitance: 470nF  [FP-0805-L_2_01_0_2-W_1_25-IPC_C]  (hidden comment: 08055C474J4Z2A)
C24  Capacitance: 470nF  [FP-0805-L_2_01_0_2-W_1_25-IPC_C]  (hidden comment: 08055C474J4Z2A)
C25  Capacitance: 470nF  [FP-0805-L_2_01_0_2-W_1_25-IPC_C]  (hidden comment: 08055C474J4Z2A)
C26  Capacitance: 470nF  [FP-0805-L_2_01_0_2-W_1_25-IPC_C]  (hidden comment: 08055C474J4Z2A)
C27  Capacitance: 470nF  [FP-0805-L_2_01_0_2-W_1_25-IPC_C]  (hidden comment: 08055C474J4Z2A)
C28  Capacitance: 470nF  [FP-0805-L_2_01_0_2-W_1_25-IPC_C]  (hidden comment: 08055C474J4Z2A)
C29  Capacitance: 470nF  [FP-0805-L_2_01_0_2-W_1_25-IPC_C]  (hidden comment: 08055C474J4Z2A)
C30  Capacitance: 470nF  [FP-0805-L_2_01_0_2-W_1_25-IPC_C]  (hidden comment: 08055C474J4Z2A)
C31  Capacitance: 470nF  [FP-0805-L_2_01_0_2-W_1_25-IPC_C]  (hidden comment: 08055C474J4Z2A)
C32  Capacitance: 470nF  [FP-0805-L_2_01_0_2-W_1_25-IPC_C]  (hidden comment: 08055C474J4Z2A)
C33  Capacitance: 470nF  [FP-0805-L_2_01_0_2-W_1_25-IPC_C]  (hidden comment: 08055C474J4Z2A)
C34  Capacitance: 470nF  [FP-0805-L_2_01_0_2-W_1_25-IPC_C]  (hidden comment: 08055C474J4Z2A)
C54  Capacitance: 470nF  [FP-0805-L_2_01_0_2-W_1_25-IPC_C]  (hidden comment: 08055C474J4Z2A)
C55  Capacitance: 470nF  [FP-0805-L_2_01_0_2-W_1_25-IPC_C]  (hidden comment: 08055C474J4Z2A)
C56  Capacitance: 470nF  [FP-0805-L_2_01_0_2-W_1_25-IPC_C]  (hidden comment: 08055C474J4Z2A)
JMP*5  Solder Jumper  [Solder Jumper-Footprint-1]  (value not drawn)
JMP*6  Solder Jumper  [Solder Jumper-Footprint-1]  (value not drawn)
JMP*7  Solder Jumper  [Solder Jumper-Footprint-1]  (value not drawn)
JMP*8  Solder Jumper  [Solder Jumper-Footprint-1]  (value not drawn)
JMP*9  Solder Jumper  [Solder Jumper-Footprint-1]  (value not drawn)
JMP*10  Solder Jumper  [Solder Jumper-Footprint-1]  (value not drawn)
JMP*11  Solder Jumper  [Solder Jumper-Footprint-1]  (value not drawn)
JMP*12  Solder Jumper  [Solder Jumper-Footprint-1]  (value not drawn)
JMP*13  Solder Jumper  [Solder Jumper-Footprint-1]  (value not drawn)
JMP*14  Solder Jumper  [Solder Jumper-Footprint-1]  (value not drawn)
JMP*23  Solder Jumper  [Solder Jumper-Footprint-1]  (value not drawn)
JMP*24  Solder Jumper  [Solder Jumper-Footprint-1]  (value not drawn)
JMP*25  Solder Jumper  [Solder Jumper-Footprint-1]  (value not drawn)
JMP*26  Solder Jumper  [Solder Jumper-Footprint-1]  (value not drawn)
JMP*27  Solder Jumper  [Solder Jumper-Footprint-1]  (value not drawn)
JMP*28  Solder Jumper  [Solder Jumper-Footprint-1]  (value not drawn)
JMP*29  Solder Jumper  [Solder Jumper-Footprint-1]  (value not drawn)
JMP*30  Solder Jumper  [Solder Jumper-Footprint-1]  (value not drawn)
JMP*31  Solder Jumper  [Solder Jumper-Footprint-1]  (value not drawn)
JMP*32  Solder Jumper  [Solder Jumper-Footprint-1]  (value not drawn)
R20  Resistance: 100R  [FP-CRCW0603-Pe3-MFG]  (hidden comment: CRCW0603100RFHEAP)
R21  Resistance: 100R  [FP-CRCW0603-Pe3-MFG]  (hidden comment: CRCW0603100RFHEAP)
R22  Resistance: 100R  [FP-CRCW0603-Pe3-MFG]  (hidden comment: CRCW0603100RFHEAP)
R23  Resistance: 100R  [FP-CRCW0603-Pe3-MFG]  (hidden comment: CRCW0603100RFHEAP)
R24  Resistance: 100R  [FP-CRCW0603-Pe3-MFG]  (hidden comment: CRCW0603100RFHEAP)
R25  Resistance: 100R  [FP-CRCW0603-Pe3-MFG]  (hidden comment: CRCW0603100RFHEAP)
R26  Resistance: 100R  [FP-CRCW0603-Pe3-MFG]  (hidden comment: CRCW0603100RFHEAP)
R27  Resistance: 100R  [FP-CRCW0603-Pe3-MFG]  (hidden comment: CRCW0603100RFHEAP)
R28  Resistance: 100R  [FP-CRCW0603-Pe3-MFG]  (hidden comment: CRCW0603100RFHEAP)
R29  Resistance: 100R  [FP-CRCW0603-Pe3-MFG]  (hidden comment: CRCW0603100RFHEAP)
R30  Resistance: 100R  [FP-CRCW0603-Pe3-MFG]  (hidden comment: CRCW0603100RFHEAP)
R31  Resistance: 100R  [FP-CRCW0603-Pe3-MFG]  (hidden comment: CRCW0603100RFHEAP)
R32  Resistance: 100R  [FP-CRCW0603-Pe3-MFG]  (hidden comment: CRCW0603100RFHEAP)
R33  Resistance: 100R  [FP-CRCW0603-Pe3-MFG]  (hidden comment: CRCW0603100RFHEAP)
R66  Resistance: 100R  [FP-CRCW0603-Pe3-MFG]  (hidden comment: CRCW0603100RFHEAP)
R67  Resistance: 100R  [FP-CRCW0603-Pe3-MFG]  (hidden comment: CRCW0603100RFHEAP)
R68  Resistance: 100R  [FP-CRCW0603-Pe3-MFG]  (hidden comment: CRCW0603100RFHEAP)

### Blocks framed on the sheet
Voltage Sensing: C21-C34 C54-C56 JMP*5-JMP*14 JMP*23-JMP*32 R20-R33 R66-R68

### Ports
+Cell1 (in, see Cell Balancing[1D], Connectors[1A]), +Cell2 (in, see Cell Balancing[1D], Connectors[1B]), +Cell3 (in, see Cell Balancing[1C], Connectors[1B]), +Cell4 (in, see Cell Balancing[1C], Connectors[1B]), +Cell5 (in, see Cell Balancing[1C], Connectors[1B]), +Cell6 (in, see Cell Balancing[1C], Connectors[1B]), +Cell7 (in, see Cell Balancing[1C], Connectors[2A]), +Cell8 (in, see Cell Balancing[1C], Connectors[2A]), +Cell9 (in, see Cell Balancing[1B], Connectors[2A]), +Cell10 (in, see Cell Balancing[1B], Connectors[2B]), +Cell11 (in, see Cell Balancing[1B], Connectors[2B]), +Cell12 (in, see Cell Balancing[1B], Connectors[2B]), +Cell13 (in, see Cell Balancing[1B], Connectors[2B]), +Cell14 (in, see Cell Balancing[1B], Connectors[2B]), +Cell15 (in, see Cell Balancing[1B], Connectors[2B]), +Cell16 (in, see Cell Balancing[1A], Connectors[2B]), -Cell1 (in, see Cell Balancing[1D], Connectors[1A]), VC0 (out, see BQ chip[2C]), VC1 (out, see BQ chip[2C]), VC2 (out, see BQ chip[2D]), VC3 (out, see BQ chip[2D]), VC4 (out, see BQ chip[2D]), VC5 (out, see BQ chip[2D]), VC6 (out, see BQ chip[2D]), VC7 (out, see BQ chip[2D]), VC8 (out, see BQ chip[2D]), VC9 (out, see BQ chip[2D]), VC10 (out, see BQ chip[1C]), VC11 (out, see BQ chip[1C]), VC12 (out, see BQ chip[1C]), VC13 (out, see BQ chip[1B]), VC14 (out, see BQ chip[1B]), VC15 (out, see BQ chip[1B]), VC16 (out, see BQ chip[1B])

### Nets
BAT: C21.2
+Cell1: R32.2 ; port +Cell1
+Cell2: R31.2 ; port +Cell2
+Cell3: R30.2 ; port +Cell3
+Cell4: R29.2 ; port +Cell4
+Cell5: R28.2 ; port +Cell5
+Cell6: JMP*31.1 R27.2 ; port +Cell6
+Cell7: JMP*29.1 JMP*31.2 R26.2 ; port +Cell7
+Cell8: JMP*13.1 JMP*29.2 R25.2 ; port +Cell8
+Cell9: JMP*11.1 JMP*13.2 R24.2 ; port +Cell9
+Cell10: JMP*9.1 JMP*11.2 R23.2 ; port +Cell10
+Cell11: JMP*7.1 JMP*9.2 R22.2 ; port +Cell11
+Cell12: JMP*5.1 JMP*7.2 R21.2 ; port +Cell12
+Cell13: JMP*5.2 JMP*27.1 R20.2 ; port +Cell13
+Cell14: JMP*25.1 JMP*27.2 R68.2 ; port +Cell14
+Cell15: JMP*23.1 JMP*25.2 R67.2 ; port +Cell15
+Cell16: JMP*23.2 R66.2 ; port +Cell16
-Cell1: R33.2 ; port -Cell1
VC0: C34.1 R33.1 ; port VC0
VC1: C33.1 C34.2 R32.1 ; port VC1
VC2: C32.1 C33.2 R31.1 ; port VC2
VC3: C31.1 C32.2 R30.1 ; port VC3
VC4: C30.1 C31.2 R29.1 ; port VC4
VC5: C29.1 C30.2 R28.1 ; port VC5
VC6: C28.1 C29.2 JMP*32.1 R27.1 ; port VC6
VC7: C27.1 C28.2 JMP*30.1 JMP*32.2 R26.1 ; port VC7
VC8: C26.1 C27.2 JMP*14.1 JMP*30.2 R25.1 ; port VC8
VC9: C25.1 C26.2 JMP*12.1 JMP*14.2 R24.1 ; port VC9
VC10: C24.1 C25.2 JMP*10.1 JMP*12.2 R23.1 ; port VC10
VC11: C23.1 C24.2 JMP*8.1 JMP*10.2 R22.1 ; port VC11
VC12: C22.1 C23.2 JMP*6.1 JMP*8.2 R21.1 ; port VC12
VC13: C22.2 C56.1 JMP*6.2 JMP*28.1 R20.1 ; port VC13
VC14: C55.1 C56.2 JMP*26.1 JMP*28.2 R68.1 ; port VC14
VC15: C54.1 C55.2 JMP*24.1 JMP*26.2 R67.1 ; port VC15
VC16: C21.1 C54.2 JMP*24.2 R66.1 ; port VC16

### Notes on the sheet
- Use jumpers to select how many cells are used
- NEED to have a mechanism somewhere to disconnect one individual cable. Either here or on some intermediary PCB.
- Radu Cristian

### Library data of the parts
C21 = CMP-1035-02704-1: as C7 on sheet Cell Balancing; Technology: SMT; Rated Voltage: 25 V; Max Thickness: 1 mm
C22-C34 C54-C56 = CMP-04427-003155-1: as C8 on sheet Cell Balancing; Dielectric: X7R; Depth: 1.25mm; Max Operating Temperature: 125°C; Mount: Surface Mount; Radiation Hardening: No; Construction: Flat; Packaging: Tape and Reel; Min Operating Temperature: -55°C; Length: 2.01mm; RoHS Compliant: Yes; Voltage Rating (DC): 50V; Case/Package: 0805; Tolerance: 5%; Package Quantity: 2000
JMP*5-JMP*14 JMP*23-JMP*32 = CMP-00000-3: 2 port solder jumper
R20-R33 R66-R68 = CMP-03613-000095-1: RES Thick Film, 100Ω, 1%, 0.1W, 50ppm/°C, 0603; Max Power Dissipation: 100mW; Military Standard: Not; Package Quantity: 5000; Length: 0.061inch; Case/Package: 0603; Packaging: Tape and Reel; Height: 0.02inch; Min Operating Temperature: -55°C; RoHS Compliant: Yes; Series: CRCW-P; Width: 0.033inch; Tolerance: 1%; Resistor Type: Thick Film; Temperature Coefficient: 50ppm/°C; Number of Terminations: 2; Depth: 0.85mm; Features: Automotive AEC-Q200; Max Operating Temperature: 155°C

## Sheet Thermistors.SchDoc
size A4; SheetNumber: 6; SheetTotal: 8
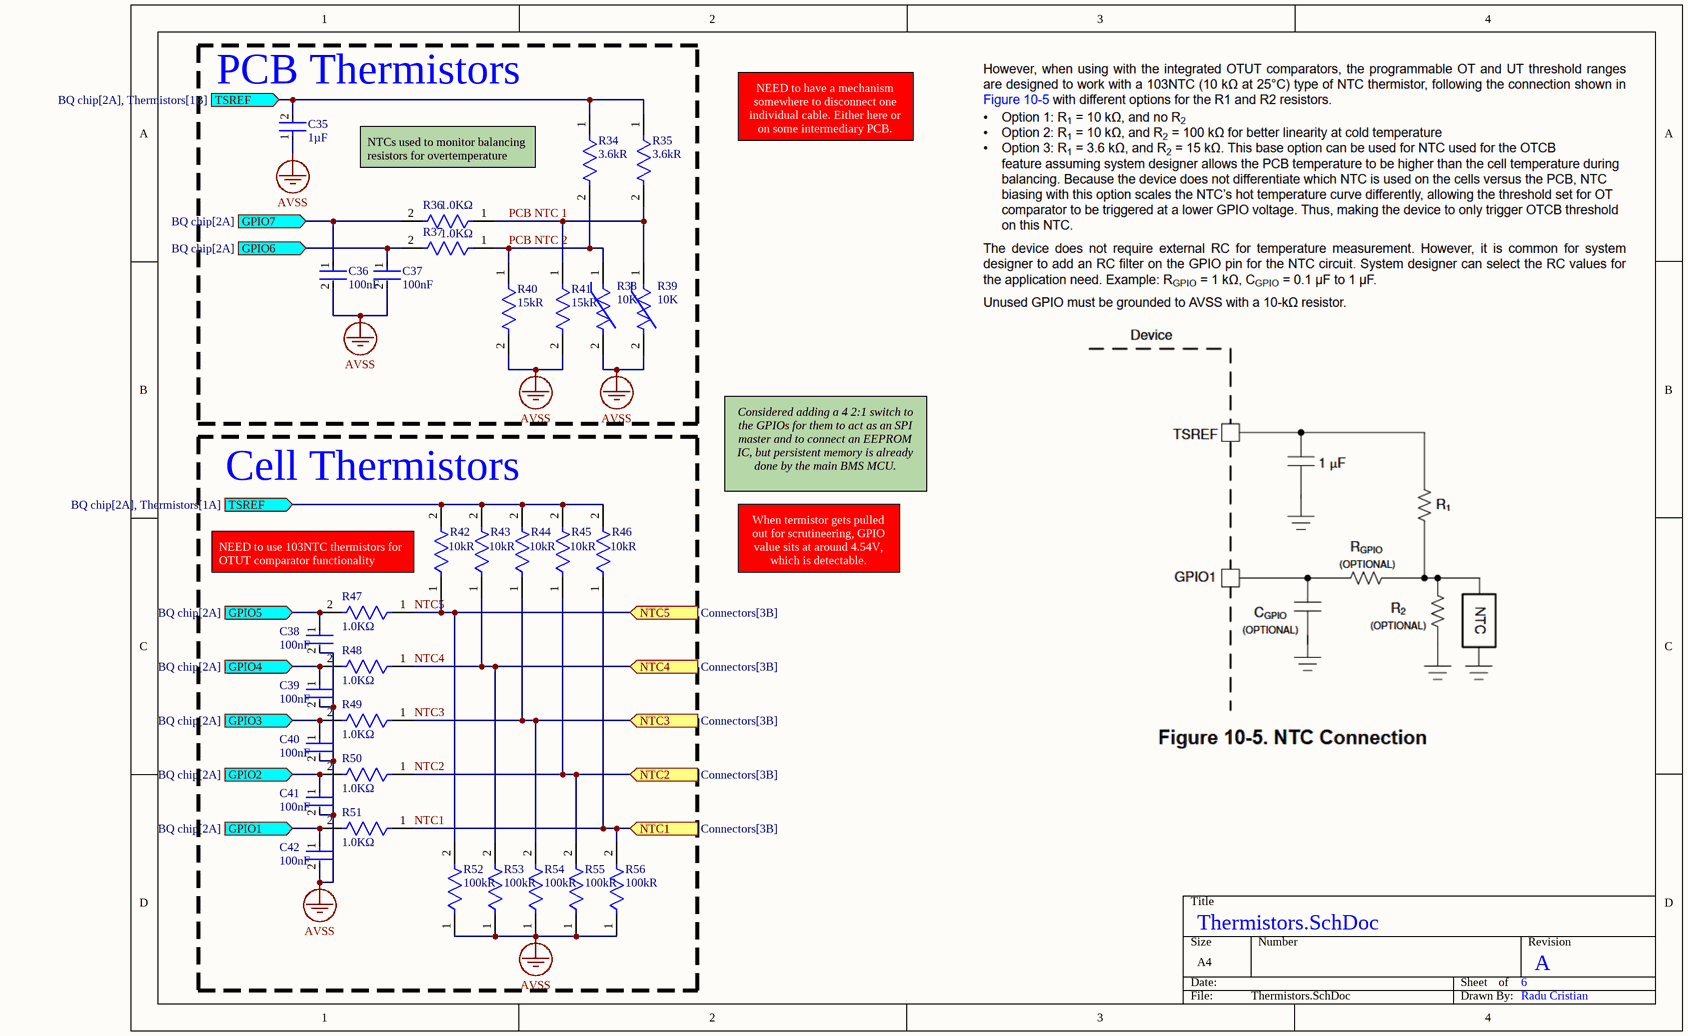
[diagram p5: Thermistors.SchDoc]

### Parts
C35  Capacitance: 1µF  [FP-VJ0603Y105KXJCW1BC-MFG]  (hidden comment: VJ0603Y105KXJCW1BC)
C36  Capacitance: 100nF  [FP-GRM188-0_1-e0_2_0_5-MFG]  (hidden comment: GRM188R72A104MA35D)
C37  Capacitance: 100nF  [FP-GRM188-0_1-e0_2_0_5-MFG]  (hidden comment: GRM188R72A104MA35D)
C38  Capacitance: 100nF  [FP-GRM188-0_1-e0_2_0_5-MFG]  (hidden comment: GRM188R72A104MA35D)
C39  Capacitance: 100nF  [FP-GRM188-0_1-e0_2_0_5-MFG]  (hidden comment: GRM188R72A104MA35D)
C40  Capacitance: 100nF  [FP-GRM188-0_1-e0_2_0_5-MFG]  (hidden comment: GRM188R72A104MA35D)
C41  Capacitance: 100nF  [FP-GRM188-0_1-e0_2_0_5-MFG]  (hidden comment: GRM188R72A104MA35D)
C42  Capacitance: 100nF  [FP-GRM188-0_1-e0_2_0_5-MFG]  (hidden comment: GRM188R72A104MA35D)
R34  Resistance: 3.6kR  [FP-AF0603-IPC_B]  (hidden comment: AF0603FR-073K6L)
R35  Resistance: 3.6kR  [FP-AF0603-IPC_B]  (hidden comment: AF0603FR-073K6L)
R36  Resistance: 1.0KΩ  [FP-CPF0603-MFG]  (hidden comment: CPF0603F1K0C1)
R37  Resistance: 1.0KΩ  [FP-CPF0603-MFG]  (hidden comment: CPF0603F1K0C1)
R38  Parameter 1: 10K  [FP-NC_18-0_15-IPC_B]  (hidden comment: NCG18XH103F0SRB)
R39  Parameter 1: 10K  [FP-NC_18-0_15-IPC_B]  (hidden comment: NCG18XH103F0SRB)
R40  Resistance: 15kR  [FP-RNCP0603-IPC_C]  (hidden comment: RNCP0603FTD15K0)
R41  Resistance: 15kR  [FP-RNCP0603-IPC_C]  (hidden comment: RNCP0603FTD15K0)
R42  Resistance: 10kR  [FP-MCT0603-IPC_C]  (hidden comment: MCT0603MC1002FP500)
R43  Resistance: 10kR  [FP-MCT0603-IPC_C]  (hidden comment: MCT0603MC1002FP500)
R44  Resistance: 10kR  [FP-MCT0603-IPC_C]  (hidden comment: MCT0603MC1002FP500)
R45  Resistance: 10kR  [FP-MCT0603-IPC_C]  (hidden comment: MCT0603MC1002FP500)
R46  Resistance: 10kR  [FP-MCT0603-IPC_C]  (hidden comment: MCT0603MC1002FP500)
R47  Resistance: 1.0KΩ  [FP-CPF0603-IPC_C]  (hidden comment: CPF0603F1K0C1)
R48  Resistance: 1.0KΩ  [FP-CPF0603-IPC_C]  (hidden comment: CPF0603F1K0C1)
R49  Resistance: 1.0KΩ  [FP-CPF0603-IPC_C]  (hidden comment: CPF0603F1K0C1)
R50  Resistance: 1.0KΩ  [FP-CPF0603-IPC_C]  (hidden comment: CPF0603F1K0C1)
R51  Resistance: 1.0KΩ  [FP-CPF0603-IPC_C]  (hidden comment: CPF0603F1K0C1)
R52  Resistance: 100kR  [FP-MCT0603-IPC_C]  (hidden comment: MCT0603MC1003FP500)
R53  Resistance: 100kR  [FP-MCT0603-IPC_C]  (hidden comment: MCT0603MC1003FP500)
R54  Resistance: 100kR  [FP-MCT0603-IPC_C]  (hidden comment: MCT0603MC1003FP500)
R55  Resistance: 100kR  [FP-MCT0603-IPC_C]  (hidden comment: MCT0603MC1003FP500)
R56  Resistance: 100kR  [FP-MCT0603-IPC_C]  (hidden comment: MCT0603MC1003FP500)

### Blocks framed on the sheet
PCB Thermistors: C35-C37 R34-R41
Cell Thermistors: C38-C42 R42-R56

### Ports
GPIO1 (in, see BQ chip[2A]), GPIO2 (in, see BQ chip[2A]), GPIO3 (in, see BQ chip[2A]), GPIO4 (in, see BQ chip[2A]), GPIO5 (in, see BQ chip[2A]), GPIO6 (in, see BQ chip[2A]), GPIO7 (in, see BQ chip[2A]), NTC1 (in, see Connectors[3B]), NTC2 (in, see Connectors[3B]), NTC3 (in, see Connectors[3B]), NTC4 (in, see Connectors[3B]), NTC5 (in, see Connectors[3B]), TSREF (in, see BQ chip[2A], Thermistors[1A]), TSREF (in, see BQ chip[2A], Thermistors[1B])

### Nets
AVSS: C35.1 C36.2 C37.2 C38.2 C39.2 C40.2 C41.2 C42.2 R38.2 R39.2 R40.2 R41.2 R52.1 R53.1 R54.1 R55.1 R56.1
GPIO1: C42.1 R51.2 ; port GPIO1
GPIO2: C41.1 R50.2 ; port GPIO2
GPIO3: C40.1 R49.2 ; port GPIO3
GPIO4: C39.1 R48.2 ; port GPIO4
GPIO5: C38.1 R47.2 ; port GPIO5
GPIO6: C37.1 R37.2 ; port GPIO6
GPIO7: C36.1 R36.2 ; port GPIO7
NTC1: R46.1 R51.1 R56.2 ; port NTC1
NTC2: R45.1 R50.1 R55.2 ; port NTC2
NTC3: R44.1 R49.1 R54.2 ; port NTC3
NTC4: R43.1 R48.1 R53.2 ; port NTC4
NTC5: R42.1 R47.1 R52.2 ; port NTC5
PCB NTC 1: R35.2 R36.1 R39.1 R41.1
PCB NTC 2: R34.2 R37.1 R38.1 R40.1
TSREF: C35.2 R34.1 R35.1 R42.2 R43.2 R44.2 R45.2 R46.2 ; port TSREF

### Notes on the sheet
- NTCs used to monitor balancing resistors for overtemperature
- NEED to have a mechanism somewhere to disconnect one individual cable. Either here or on some intermediary PCB.
- Considered adding a 4 2:1 switch to the GPIOs for them to act as an SPI master and to connect an EEPROM IC, but persistent memory is already done by the main BMS MCU.
- NEED to use 103NTC thermistors for OTUT comparator functionality
- When termistor gets pulled out for scrutineering, GPIO value sits at around 4.54V, which is detectable.
- Radu Cristian

### Library data of the parts
C35 = CMP-00030-45106517-1: as C58 on sheet BQ chip; Radiation Hardening: No; RoHS: Compliant; Packaging: Tape and Reel; Material: Ceramic; Height: 950µm; Voltage Rating (DC): 16V; Tolerance: 10%; NexarPartId: 45106517; Min Operating Temperature: -55°C; Depth: 800µm; Case/Package: 0603; Length: 1.6mm; Max Operating Temperature: 125°C; Mount: Surface Mount; Lead Free: Lead Free; Dielectric: X7R
C36-C42 = CMP-06035-009454-1: Chip Multilayer Ceramic Capacitors for General Purpose, 0603, 0.10uF, X7R, 15%, 20%, 100V; Voltage Rating (DC): 100V; Dielectric: X7R; Width: 800um; Tolerance: 20%; Thickness: 800um; Length: 1.6mm
R34 R35 = CMP-03412-047053-1: Anti-Sulfurated Chip Resistors Automotive Grade 3.6kΩ 1% 100ppm/°C 0603; Max Power Dissipation: 100mW; Packaging: Tape and Reel; Series: AF; Case/Package: 0603; Temperature Coefficient: 100ppm/°C; Max Operating Temperature: 155°C; Height: 0.022inch; Width: 0.031inch; Features: Moisture Resistant; RoHS Compliant: Yes; Min Operating Temperature: -55°C; Length: 0.063inch; Resistor Type: Thick Film; Number of Terminations: 2; Tolerance: 1%
R36 R37 R47-R51 = CMP-03211-002621-1: as R1 on sheet BQ chip; Octopart: https://octopart.com/cpf0603f1k0c1-te+connectivity-42013134; packaging: 1k Reel; Category: Res; Device Class L3: Chip SMD Resistors; octopart_url: https://octopart.com/cpf0603f1k0c1-te+connectivity-42013134; Value: 1.0KΩ; Temperature: -55°C to +155°C; Composition: Thin Film; ComponentLink2URL: https://www.te.com/commerce/DocumentDelivery/DDEController?Action=showdoc&DocId=Data+Sheet%7F1773200%7FM%7Fpdf%7FEnglish%7FENG_DS_1773200_M.pdf%7F3-1676481-2; Tolerance: 1%; Automotive: No; Lead Free: Yes; Height: 0.55mm; Device Class L1: Passive Components; Device Class L2: Resistors; Ipc Land Pattern Name: RESC15580X45; Series: CPF; ComponentLink2Description: Datasheet; RoHS: TRUE; Package: CPF0603; Manufacturer Part Number: CPF0603F1K0C1; Temperature Range Low: -55°C; Temperature Range High: +155°C
R38 R39 = CMP-06022-000566-1: NTC Thermistor 10kΩ 1% SMD  0201 (0603 Metric); Min Operating Temperature: -55°C; Case/Package: 0603; Tolerance: 1%; Max Operating Temperature: 150°C; Number of Pins: 2; Length: 1.6mm; Packaging: Tape and Reel; Depth: 0.8mm
R40 R41 = CMP-26527-006590-1: 15kΩ ±1% 0.125W 0603 High Power Anti-Sulfur Thin Film Chip Resistor; Max Power Dissipation: 125mW; Temperature Coefficient: 100ppm/°C; Tolerance: 1%; Case Code (Metric): 1608; Features: Moisture Resistant; Case/Package: 0603; Resistor Type: Thin Film; Height: 0.02inch; Length: 0.059inch; Max Operating Temperature: 155°C; Packaging: Tape and Reel; Width: 0.031inch; Number of Terminations: 2; Min Operating Temperature: -55°C; Case Code (Imperial): 0603; Mount: Surface Mount; Lead Free: Lead Free; RoHS Compliant: Yes; Series: RNCP
R42-R46 = CMP-02407-001346-1: RES SMD 100 OHM 1% 1/8W 0603; Voltage Rating: 75V; Power Rating: 125mW; Length: 1.6mm; Case Code (Metric): 1608; Composition: Thin Film; Height: 0.45mm; Weight: 7.1E-05oz; Min Operating Temperature: -55°C; Packaging: Tape and Reel; Width: 0.8mm; Case/Package: 0603; Tolerance: 1%; Termination: SMD/SMT; Package Quantity: 5000; Case Code (Imperial): 0603; Max Operating Temperature: 155°C
R52-R56 = CMP-02407-008119-1: RES SMD 100 OHM 1% 1/8W 0603; Voltage Rating: 75V; Power Rating: 125mW; Length: 1.55mm; Packaging: Tape and Reel; Width: 0.85mm; Case Code (Metric): 1608; Weight: 6.7E-05oz; Tolerance: 1%; Height: 0.45mm; Case Code (Imperial): 0603; Max Operating Temperature: 175°C; Case/Package: 0603; Min Operating Temperature: -55°C; Composition: Thin Film

## Sheet Communication.SchDoc
size A4; SheetNumber: 7; SheetTotal: 8
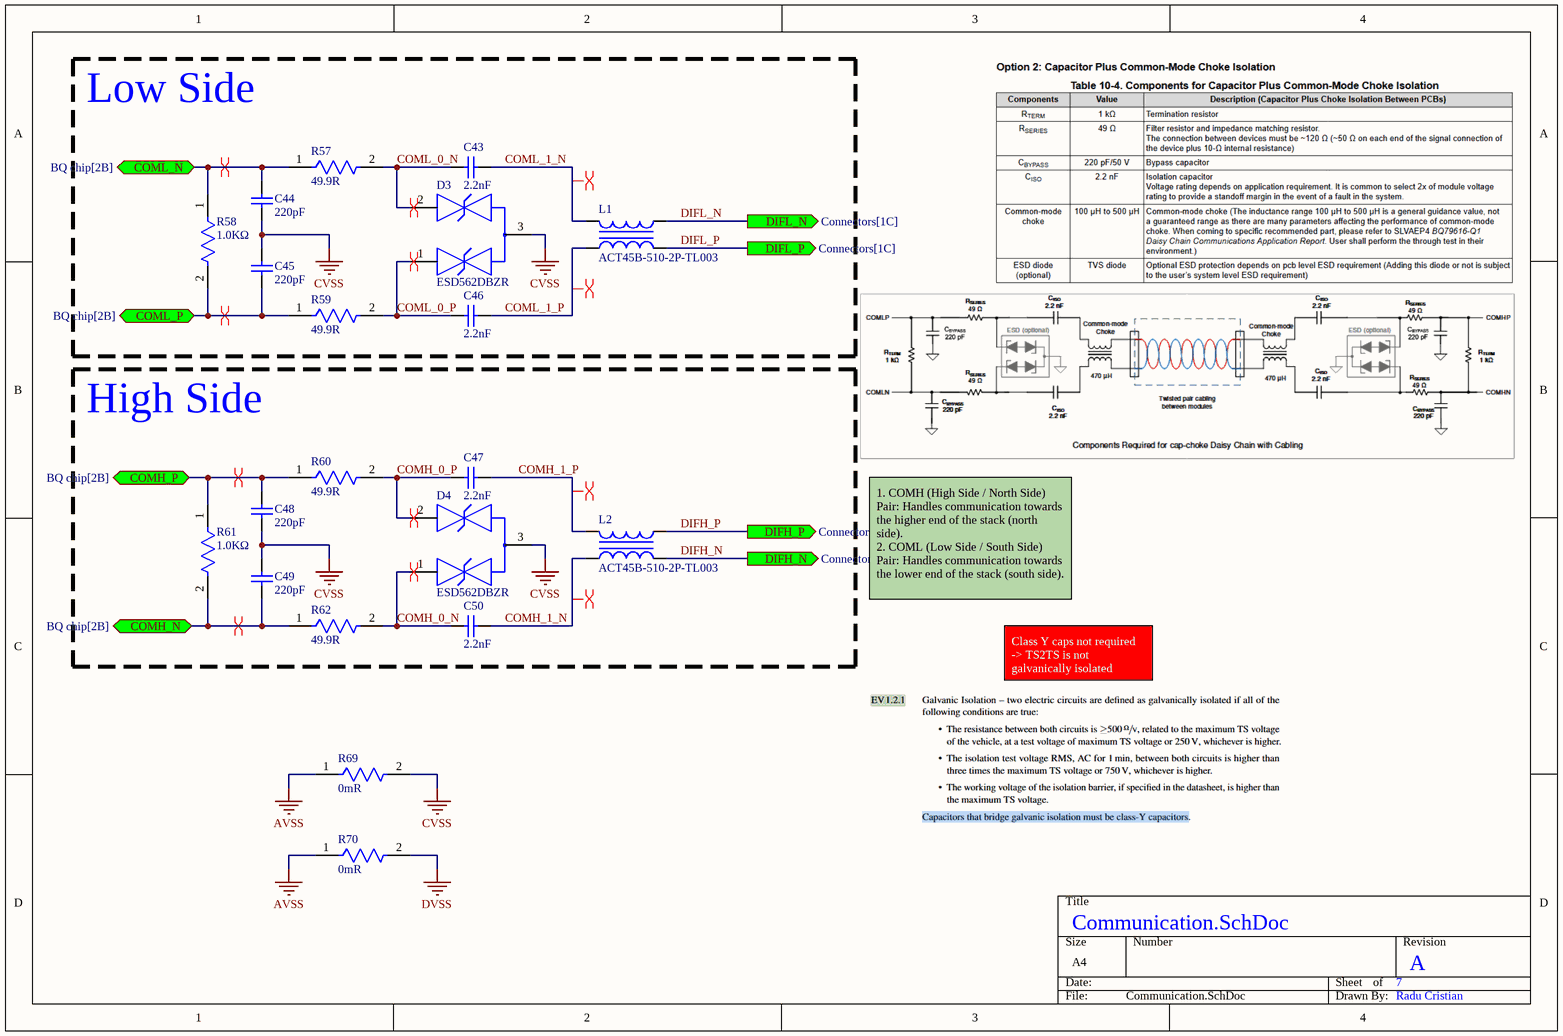
[diagram p6: Communication.SchDoc]

### Parts
C43  Parameter 1: 2.2nF  [CAPC1608X92X38ML15T08]  (hidden comment: VJ0603Y222JXBAC)
C44  value 220pF  [CAPC0603(1608)100_N]  (hidden comment: CAP 220pF 100V 0603(1608))
C45  value 220pF  [CAPC0603(1608)100_N]  (hidden comment: CAP 220pF 100V 0603(1608))
C46  Parameter 1: 2.2nF  [CAPC1608X92X38ML15T08]  (hidden comment: VJ0603Y222JXBAC)
C47  Parameter 1: 2.2nF  [CAPC1608X92X38ML15T08]  (hidden comment: VJ0603Y222JXBAC)
C48  value 220pF  [CAPC0603(1608)100_N]  (hidden comment: CAP 220pF 100V 0603(1608))
C49  value 220pF  [CAPC0603(1608)100_N]  (hidden comment: CAP 220pF 100V 0603(1608))
C50  Parameter 1: 2.2nF  [CAPC1608X92X38ML15T08]  (hidden comment: VJ0603Y222JXBAC)
D3  ESD562DBZR  [FP-DBZ0003A-MFG]
D4  ESD562DBZR  [FP-DBZ0003A-MFG]
L1  ACT45B-510-2P-TL003  [TDK-ACT45B-510-2P-TL003-4_V]
L2  ACT45B-510-2P-TL003  [TDK-ACT45B-510-2P-TL003-4_V]
R57  Resistance: 49.9R  [FP-CRCW0603-HPe3-MFG]  (hidden comment: CRCW060349R9FKECHP)
R58  Resistance: 1.0KΩ  [FP-CPF0603-MFG]  (hidden comment: CPF0603F1K0C1)
R59  Resistance: 49.9R  [FP-CRCW0603-HPe3-MFG]  (hidden comment: CRCW060349R9FKECHP)
R60  Resistance: 49.9R  [FP-CRCW0603-HPe3-MFG]  (hidden comment: CRCW060349R9FKECHP)
R61  Resistance: 1.0KΩ  [FP-CPF0603-MFG]  (hidden comment: CPF0603F1K0C1)
R62  Resistance: 49.9R  [FP-CRCW0603-HPe3-MFG]  (hidden comment: CRCW060349R9FKECHP)
R69  Resistance: 0mR  [FP-MCT0603-MFG]  (hidden comment: MCT06030Z0000ZPW00)
R70  Resistance: 0mR  [FP-MCT0603-MFG]  (hidden comment: MCT06030Z0000ZPW00)

### Blocks framed on the sheet
Low Side: C43-C46 D3 L1 R57-R59
High Side: C47-C50 D4 L2 R60-R62

### Ports
COMH_N (bidir, see BQ chip[2B]), COMH_P (bidir, see BQ chip[2B]), COML_N (bidir, see BQ chip[2B]), COML_P (bidir, see BQ chip[2B]), DIFH_N (out, see Connectors[2C]), DIFH_P (out, see Connectors[2C]), DIFL_N (out, see Connectors[1C]), DIFL_P (out, see Connectors[1C])

### Nets
AVSS: R69.1 R70.1
CVSS: C44.2 C45.1 C48.2 C49.1 D3.3(GND) D4.3(GND) R69.2
DVSS: R70.2
COMH_0_N: C50.2 D4.1(1_IO) R62.2
COMH_0_P: C47.2 D4.2(2_IO) R60.2
COMH_1_N: C50.1 L2.2
COMH_1_P: C47.1 L2.1
COMH_N: C49.2 R61.2 R62.1 ; port COMH_N
COMH_P: C48.1 R60.1 R61.1 ; port COMH_P
COML_0_N: C43.2 D3.2(2_IO) R57.2
COML_0_P: C46.2 D3.1(1_IO) R59.2
COML_1_N: C43.1 L1.1
COML_1_P: C46.1 L1.2
COML_N: C44.1 R57.1 R58.1 ; port COML_N
COML_P: C45.2 R58.2 R59.1 ; port COML_P
DIFH_N: L2.3 ; port DIFH_N
DIFH_P: L2.4 ; port DIFH_P
DIFL_N: L1.4 ; port DIFL_N
DIFL_P: L1.3 ; port DIFL_P

### Layout directives
differential pair: COMH_0_N, COMH_0_P, COMH_1_N, COMH_1_P, COMH_N, COMH_P, COML_0_N, COML_0_P, COML_1_N, COML_1_P, COML_N, COML_P

### Notes on the sheet
- 1. COMH (High Side / North Side) Pair: Handles communication towards the higher end of the stack (north side).
  2. COML (Low Side / South Side) Pair: Handles communication towards the lower end of the stack (south side).
- Class Y caps not required -> TS2TS is not galvanically isolated
- Radu Cristian

### Library data of the parts
C43 C46 C47 C50 = CMP-2006-01264-1: Manufacturer: Vitramon; Part Number: VJ0603Y222JXBAC
C44 C45 C48 C49 = CMP-1035-01477-1: CAP 220pF 100V ±10% 0603 (1608 Metric) Thickness 1mm SMD; Tolerance: Â±10%; Case-EIA: 0603; Case-Metric: 1608; Rated Voltage: 100 V; Max Thickness: 1 mm; Technology: SMT
D3 D4 = CMP-00370-147404550-1: ESD562DBZR Two-channel bidirectional 12V ESD protection diode 3-SOT-23 -40 to 125; Manufacturer Lifecycle Status: ACTIVE; NexarPartId: 147404550; Thickness: 1mm; Length: 2.92mm; Number of Pins: 3; Height: 1.22mm; Lifecycle Status: Production; Width: 1.3mm; Case/Package: SOT-23
L1 L2 = CMP-2000-05391-1: Common-Mode Choke for CAN Bus System, 51uH, 50 V DC, -40 to 150 degC, 4-Pin SMD, RoHS, Tape and Reel; Manufacturer: TDK; Number of Lines: 2; Impedance: 2.8kOhm; Current: 200mA; Featured Product: FerriteChipCommon-ModeFilterforCAN-BUSSystem; Inductance: 51µH; Other Names: 445-3958-6; Filter Type: Data,SignalLine; DC Resistance (DCR): 1OhmMax; Dynamic Catalog: ACTSeries; Other Drawings: ACM3225SeriesSchematic / ACT45B-xxx-2P_Footprint; Catalog Drawings: (ACM4532,ACT45B)-xxx-2P_Top / ACT45B-xxx-2P_Side / ACT45B-xxx-2P_Bottom; Package / Case: Horizontal,4PCPad; Family: CommonModeChokes; Datasheet Version: Aug-12; Height (Max): 0.118"(3.00mm); Packaging: Digi-Reel; Category: Filters; Datasheet URL: https://datasheet.ciiva.com/22726/1649098-22726290.pdf; Mounting Type: SurfaceMount; Operating Temperature: -40degC~150degC; Size / Dimension: 0.177"Lx0.126"W(4.50mmx3.20mm); Series: ACT; Manufacturer URL: http://www.tdk.com/; Standard Package: 1
R57 R59 R60 R62 = CMP-02407-009504-1: RES Thick Film, 49.9Ω, 1%, 0.33W, 100ppm/°C, 0603; Power Rating: 100mW; Tolerance: 1%; Case/Package: 0603; Lead Free: Lead Free
R58 R61 = CMP-03211-002621-1: as R1 on sheet BQ chip; Octopart: https://octopart.com/cpf0603f1k0c1-te+connectivity-42013134; packaging: 1k Reel; Category: Res; Device Class L3: Chip SMD Resistors; octopart_url: https://octopart.com/cpf0603f1k0c1-te+connectivity-42013134; Value: 1.0KΩ; Temperature: -55°C to +155°C; Composition: Thin Film; ComponentLink2URL: https://www.te.com/commerce/DocumentDelivery/DDEController?Action=showdoc&DocId=Data+Sheet%7F1773200%7FM%7Fpdf%7FEnglish%7FENG_DS_1773200_M.pdf%7F3-1676481-2; Tolerance: 1%; Automotive: No; Lead Free: Yes; Height: 0.55mm; Device Class L1: Passive Components; Device Class L2: Resistors; Ipc Land Pattern Name: RESC15580X45; Series: CPF; ComponentLink2Description: Datasheet; RoHS: TRUE; Package: CPF0603; Manufacturer Part Number: CPF0603F1K0C1; Temperature Range Low: -55°C; Temperature Range High: +155°C
R69 R70 = CMP-02407-001569-1: RES SMD 100 OHM 1% 1/8W 0603; Power Rating: 100mW; Contact Plating: Tin; Termination: Wraparound; Military Standard: Not; Composition: Thin Film; Min Operating Temperature: -55°C; Depth: 0.85mm; Max Operating Temperature: 125°C; Number of Terminations: 2; Case/Package: 0603; Height: 0.022inch; Width: 0.033inch; Lead Free: Lead Free; Length: 1.55mm; Mount: Surface Mount; Packaging: Tape and Reel; Max Power Dissipation: 100mW